# EAGLE design utilidong-ftdi-uart-mk-2.0 (EAGLE 7.5.0)
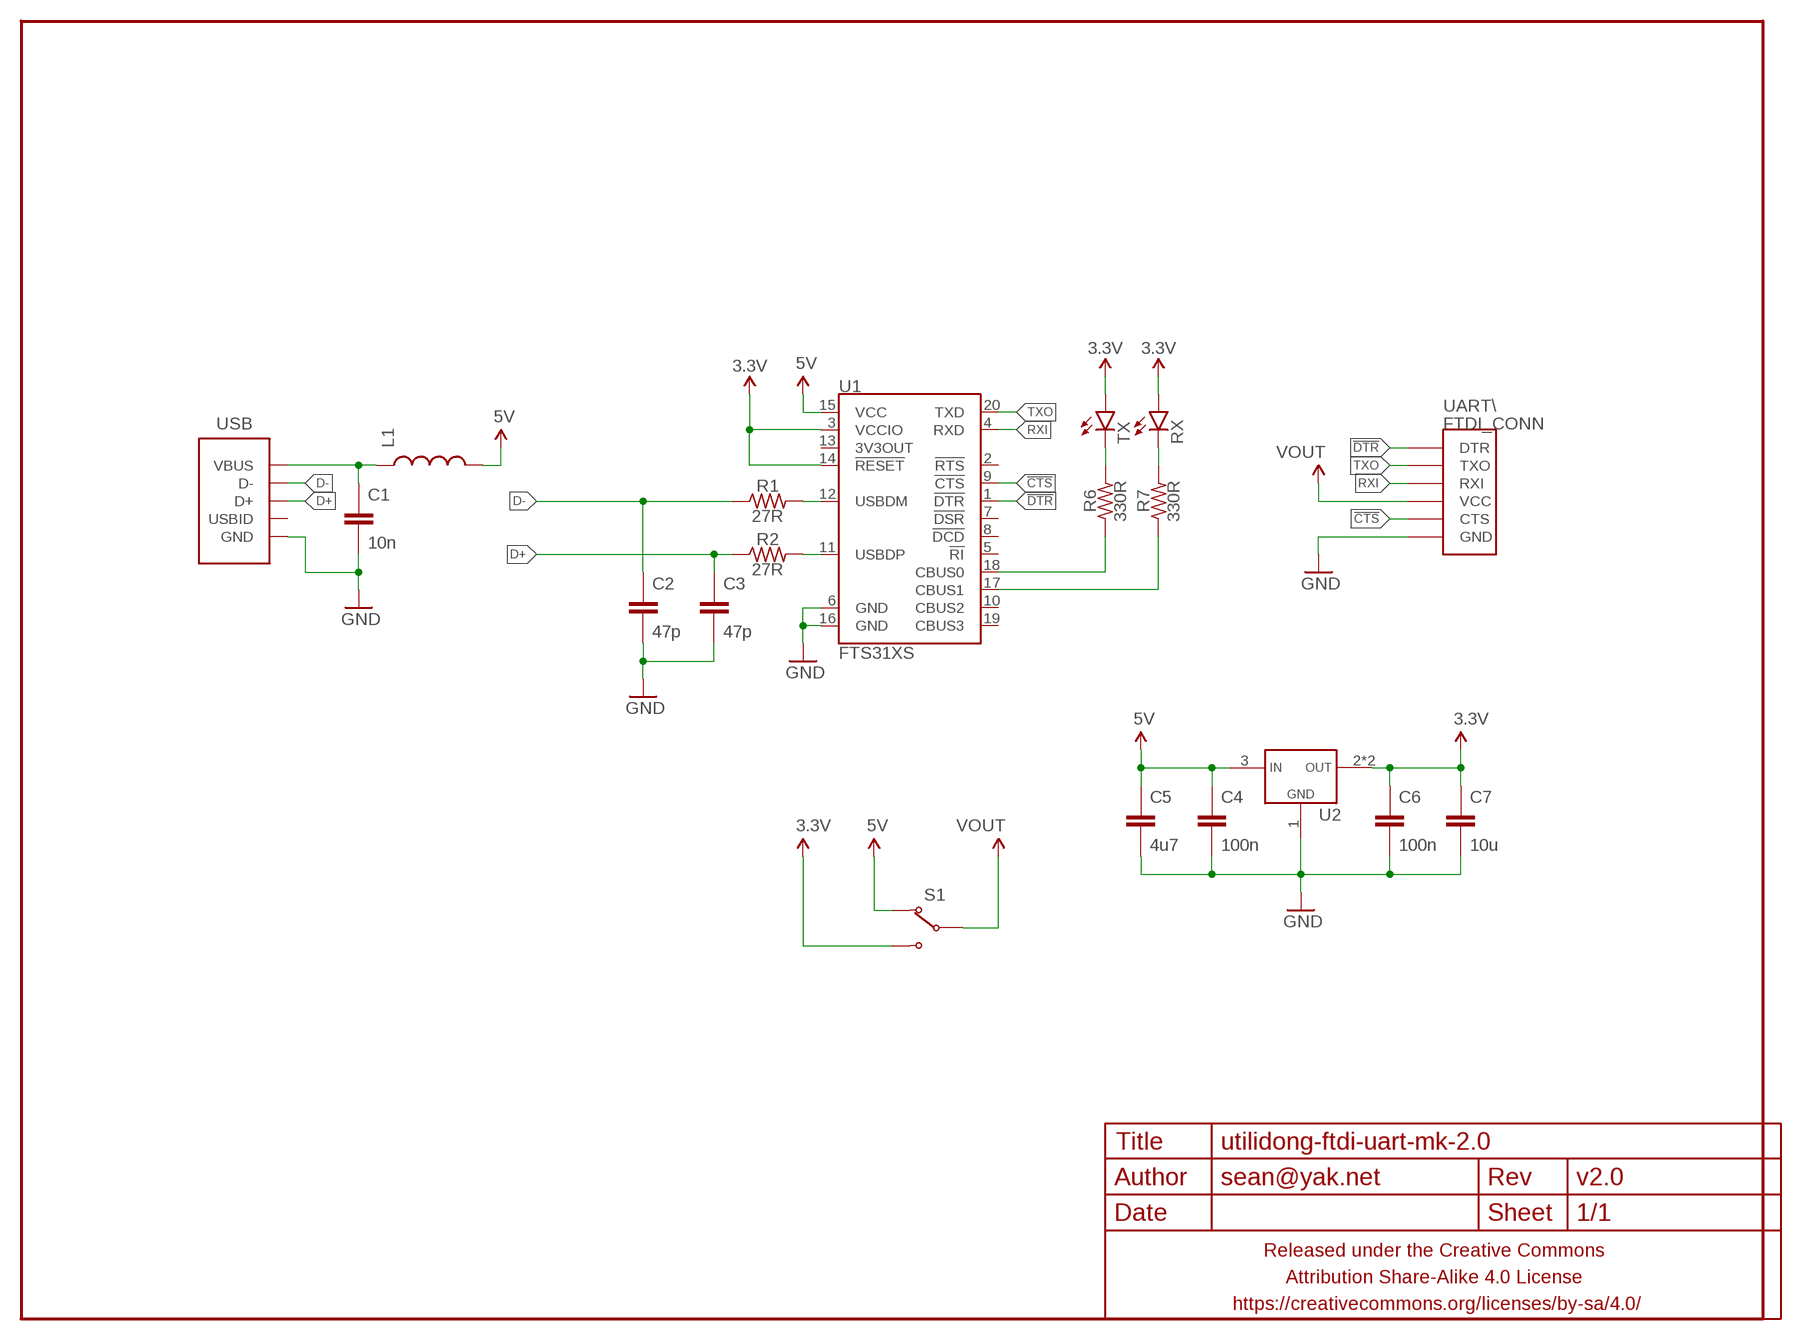
[diagram p0: schematic, sheet 1]

## Parts
C1  10n  CAPACITOR-CERAMICC0603  [C0603]
C2  47p  CAPACITOR-CERAMICC0603  [C0603]
C3  47p  CAPACITOR-CERAMICC0603  [C0603]
C4  100n  CAPACITOR-CERAMICC0603  [C0603]
C5  4u7  CAPACITOR-CERAMICC0603  [C0603]
C6  100n  CAPACITOR-CERAMICC0603  [C0603]
C7  10u  CAPACITOR-CERAMICC0805  [C0805]
FRAME1  FRAME-LETTERNO_PACKAGE  [DUMMY]
L1  INDUCTOR0603  [0603]
R1  27R  RESISTORR0603  [R0603]
R2  27R  RESISTORR0603  [R0603]
R6  330R  RESISTORR0603  [R0603]
R7  330R  RESISTORR0603  [R0603]
RX  LED0603  [LED-0603]
S1  SWITCH-SPDTSMD-RA  [SWITCH-SPDT-SMD-RA]
TX  LED0603  [LED-0603]
U1  FTS31XS  FT231XS  [SSOP20_L]
U2  VREG_1117SOT89  [SOT89]
UART\  FTDI_CONN  [FTDI_CONN]
USB  USB-ABFCI-10103594-USB-MICRO-B-LESS  [FCI-10103594-USB-MICRO-B-LESS]

## Nets
3.3V: C6.1 C7.1 RX.A S1.1(NO) TX.A U1.3(VCCIO) U1.14(!RESET) U2.2(VOUT) U2.4(VOUT)
5V: C4.1 C5.1 L1.2 S1.3(NC) U1.15(VCC) U2.3(VIN)
!CTS: U1.9(!CTS) UART\.CTS
!DTR: U1.1(!DTR) UART\.DTR
D+: C3.1 R2.1 USB.3(D+)
D-: C2.1 R1.1 USB.2(D-)
GND: C1.2 C2.2 C3.2 C4.2 C5.2 C6.2 C7.2 U1.6(GND) U1.16(GND) U2.1(GND) UART\.GND USB.5(GND)
N$1: R1.2 U1.12(USBDM)
N$2: R2.2 U1.11(USBDP)
N$3: C1.1 L1.1 USB.1(VBUS)
N$7: R6.1 U1.18(CBUS0)
N$9: R6.2 TX.C
N$10: R7.2 RX.C
N$12: R7.1 U1.17(CBUS1)
RXI: U1.4(RXD) UART\.RXI
TXO: U1.20(TXD) UART\.TXO
VOUT: S1.2(COM) UART\.VCC
Unconnected: U1.2(!RTS) U1.5(!RI) U1.7(!DSR) U1.8(!DCD) U1.10(CBUS2) U1.13(3V3OUT) U1.19(CBUS3) USB.4(USBID)

## Library data of the parts
C1-C7 = a_parts:CAPACITOR-CERAMIC: CAPACITOR, European symbol
FRAME1 = A_butts:FRAME-LETTER: Schematic Frame Standard 8.5x11 US Letter frame; DESIGNER: sean@yak.net; VERSION: v2.0
L1 = a_parts:INDUCTOR: Inductors Basic Inductor/Choke - 0603 and 1206. Footprints are not proven and vary greatly between part numbers. SRN6045- 33uH, 20% 1.4A SDR0403-560KL - 56uH, 10%, 500mA RMS/740mA peak
R1 R2 R6 R7 = a_parts:RESISTOR: RESISTOR, American symbol
RX TX = a_parts:LED: LEDs Standard schematic elements and footprints for 5mm, 3mm, 1206, and 0603 sized LEDs. 5mm - Spark Fun Electronics SKU : COM-00529 (and others)
S1 = a_parts:SWITCH-SPDT
U1 = a_parts:FT231X: FTDI FT231X Full Speed USB to Full-handshake UART This USB2.0 Full Speed IC offers a compact bridge to full handshake UART interfaces. The device is a UART, capable of operating up to 3MBaud, with low power consumption (8mA). The FT231X includes the complete FT-X series feature set and enables USB to be added into a system design quickly and easily over a UART interface.; PROD_ID: IC-11524; VALUE: FTS31XS-U
U2 = a_parts:VREG_1117
UART\ = A_butts:FTDI_CONN: Connector which mates to FTDI basic or FTDI cable.
USB = a_parts:USB-AB: This is a USB AB connector that is compatible with USB OTG. i.e. this connector can serve as a host or device

## Board
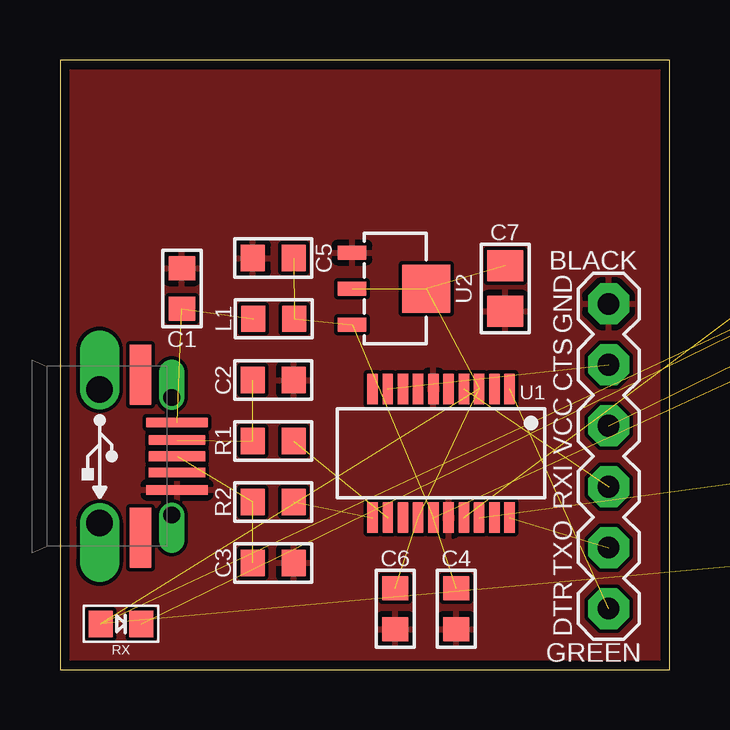
[diagram p1: board, top side]
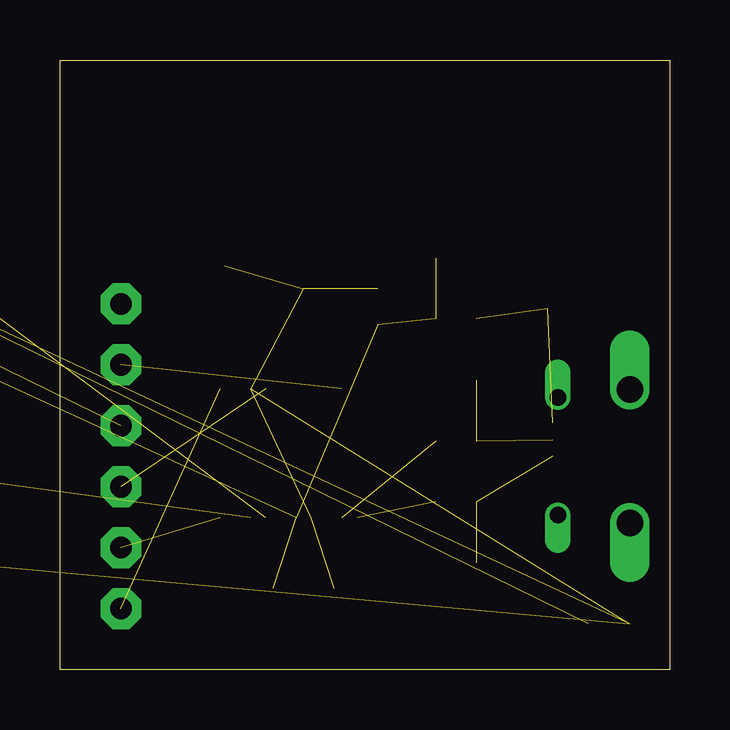
[diagram p2: board, bottom side, seen from below]

Size 25.4 x 25.4 mm. Coordinates in mm from the lower left corner, seen from the top.
Outline: 25.4,0 25.4,25.4 0,25.4 0,0 25.4,0
Copper layers (1*16): Top 0.0356mm / dielectric 1.5011mm / Bottom 0.0356mm
Design rules "LaenPCBOrder_2": minimum track width 6mil, minimum drill 13mil, track to track 6mil, track to pad 6mil, pad to pad 6mil, via to via 6mil, smd to smd 6mil, copper to edge 15mil, drill to drill 6mil, minimum pad ring 7mil, minimum via ring 7mil, stop-mask expansion 3mil, vias tented up to drill 20mil, thermal gap 10mil

### Footprints (pad centres in the part's own frame; a part is rotated, then mirrored left to right if it is on the bottom)
C0603 = smd 1 x 1.1: 1 -0.85,0; 2 0.85,0
C0805 = smd 1.3 x 1.5: 1 -0.95,0; 2 0.95,0
0603 = smd 1 x 1.1: 1 -0.85,0; 2 0.85,0
R0603 = smd 1 x 1.1: 1 -0.85,0; 2 0.85,0
LED-0603 = smd 1.1 x 1: A 0,-0.85; C 0,0.85
SWITCH-SPDT-SMD-RA = smd 1.2 x 2.5: 1 -2.5,0; 2 0,0; 3 2.5,0 | hole 0.9: -3.4,-2.75; 3.4,-2.75
SSOP20_L = smd 0.43 x 1.27: 1 -2.857,-2.68; 2 -2.223,-2.68; 3 -1.587,-2.68; 4 -0.953,-2.68; 5 -0.318,-2.68; 6 0.318,-2.68; 7 0.953,-2.68; 8 1.587,-2.68; 9 2.223,-2.68; 10 2.857,-2.68; 11 2.857,2.68; 12 2.223,2.68; 13 1.587,2.68; 14 0.953,2.68; 15 0.318,2.68; 16 -0.318,2.68; 17 -0.953,2.68; 18 -1.587,2.68; 19 -2.223,2.68; 20 -2.857,2.68
SOT89 = smd 0.58 x 1.2: 1 -1.5,-1.8; 2 0,-1.8; 3 1.5,-1.8 | smd 2 x 2: 4 0,1.3
FTDI_CONN = drill 0.9 pad 1.7 octagon: CTS 3.81,0; DTR -6.35,0; GND 6.35,0; RXI -1.27,0; TXO -3.81,0; VCC 1.27,0
FCI-10103594-USB-MICRO-B-LESS = smd 0.4 x 2.55: 1 -1.4,3.225; 5 1.4,3.225 | smd 0.4 x 2.35: 2 -0.675,3.225; 3 0,3.225; 4 0.675,3.225 | drill 0.7 offset: SHIELD@1 -2.45,3; SHIELD@2 2.45,3 | drill 1.1 pad 1.3 offset: SHIELD@3 -2.775,0; SHIELD@4 2.775,0 | smd 2.5 x 0.9: SHIELD@5 -3.4,1.7; SHIELD@6 3.4,1.7

### Placement (x,y rotation side)
C1  5.08,15.88 90 top
C2  8.89,12.06 0 top
C3  8.89,4.45 0 top
C4  16.51,2.54 270 top
C5  8.89,17.14 180 top
C6  13.97,2.54 270 top
C7  18.54,15.88 270 top
FRAME1  0,0 0 top
L1  8.9,14.62 0 top
R1  8.89,9.53 0 top
R2  8.89,6.99 0 top
R6  33.27,7.62 270 top  (outside the outline)
R7  31.75,16.64 270 top  (outside the outline)
RX  2.54,1.91 270 top
S1  45.21,21.08 0 top  (outside the outline)
TX  32,4.57 270 top  (outside the outline)
U1  15.88,9.02 180 top
U2  13.97,15.88 270 top
U$3  [COW_SMALL]  40.02,8.3 0 bottom  (outside the outline)
U$4  [CC-BY-SA-4.0-NO-URL]  38.64,15.29 0 bottom  (outside the outline)
U$6  [OSHWLOGO_TOP_0.2_A]  35.43,20.37 0 bottom  (outside the outline)
UART\  22.86,8.89 90 top
USB  1.65,8.89 270 top

### Tracks (layer width: path | path; a pad name or v marks a point on that pad's centre or on a via)
3.3V  (8 unrouted)
5V  (5 unrouted)
!CTS  (1 unrouted)
!DTR  (1 unrouted)
D+  (2 unrouted)
D-  (2 unrouted)
GND
  pour Top: 25.4,25.4 25.4,0 0,0 0,25.4
N$1  (1 unrouted)
N$2  (1 unrouted)
N$3  (2 unrouted)
N$7  (1 unrouted)
N$9  (1 unrouted)
N$10  (1 unrouted)
N$12  (1 unrouted)
RXI  (1 unrouted)
TXO  (1 unrouted)
VOUT  (1 unrouted)

### Text on the board
bPlace: by schizobovine / <sean@yak.net> | Utilidong USB-to-UART